# Altium schematic sheet JlinkV9-SMTV2.SchDoc
size A3
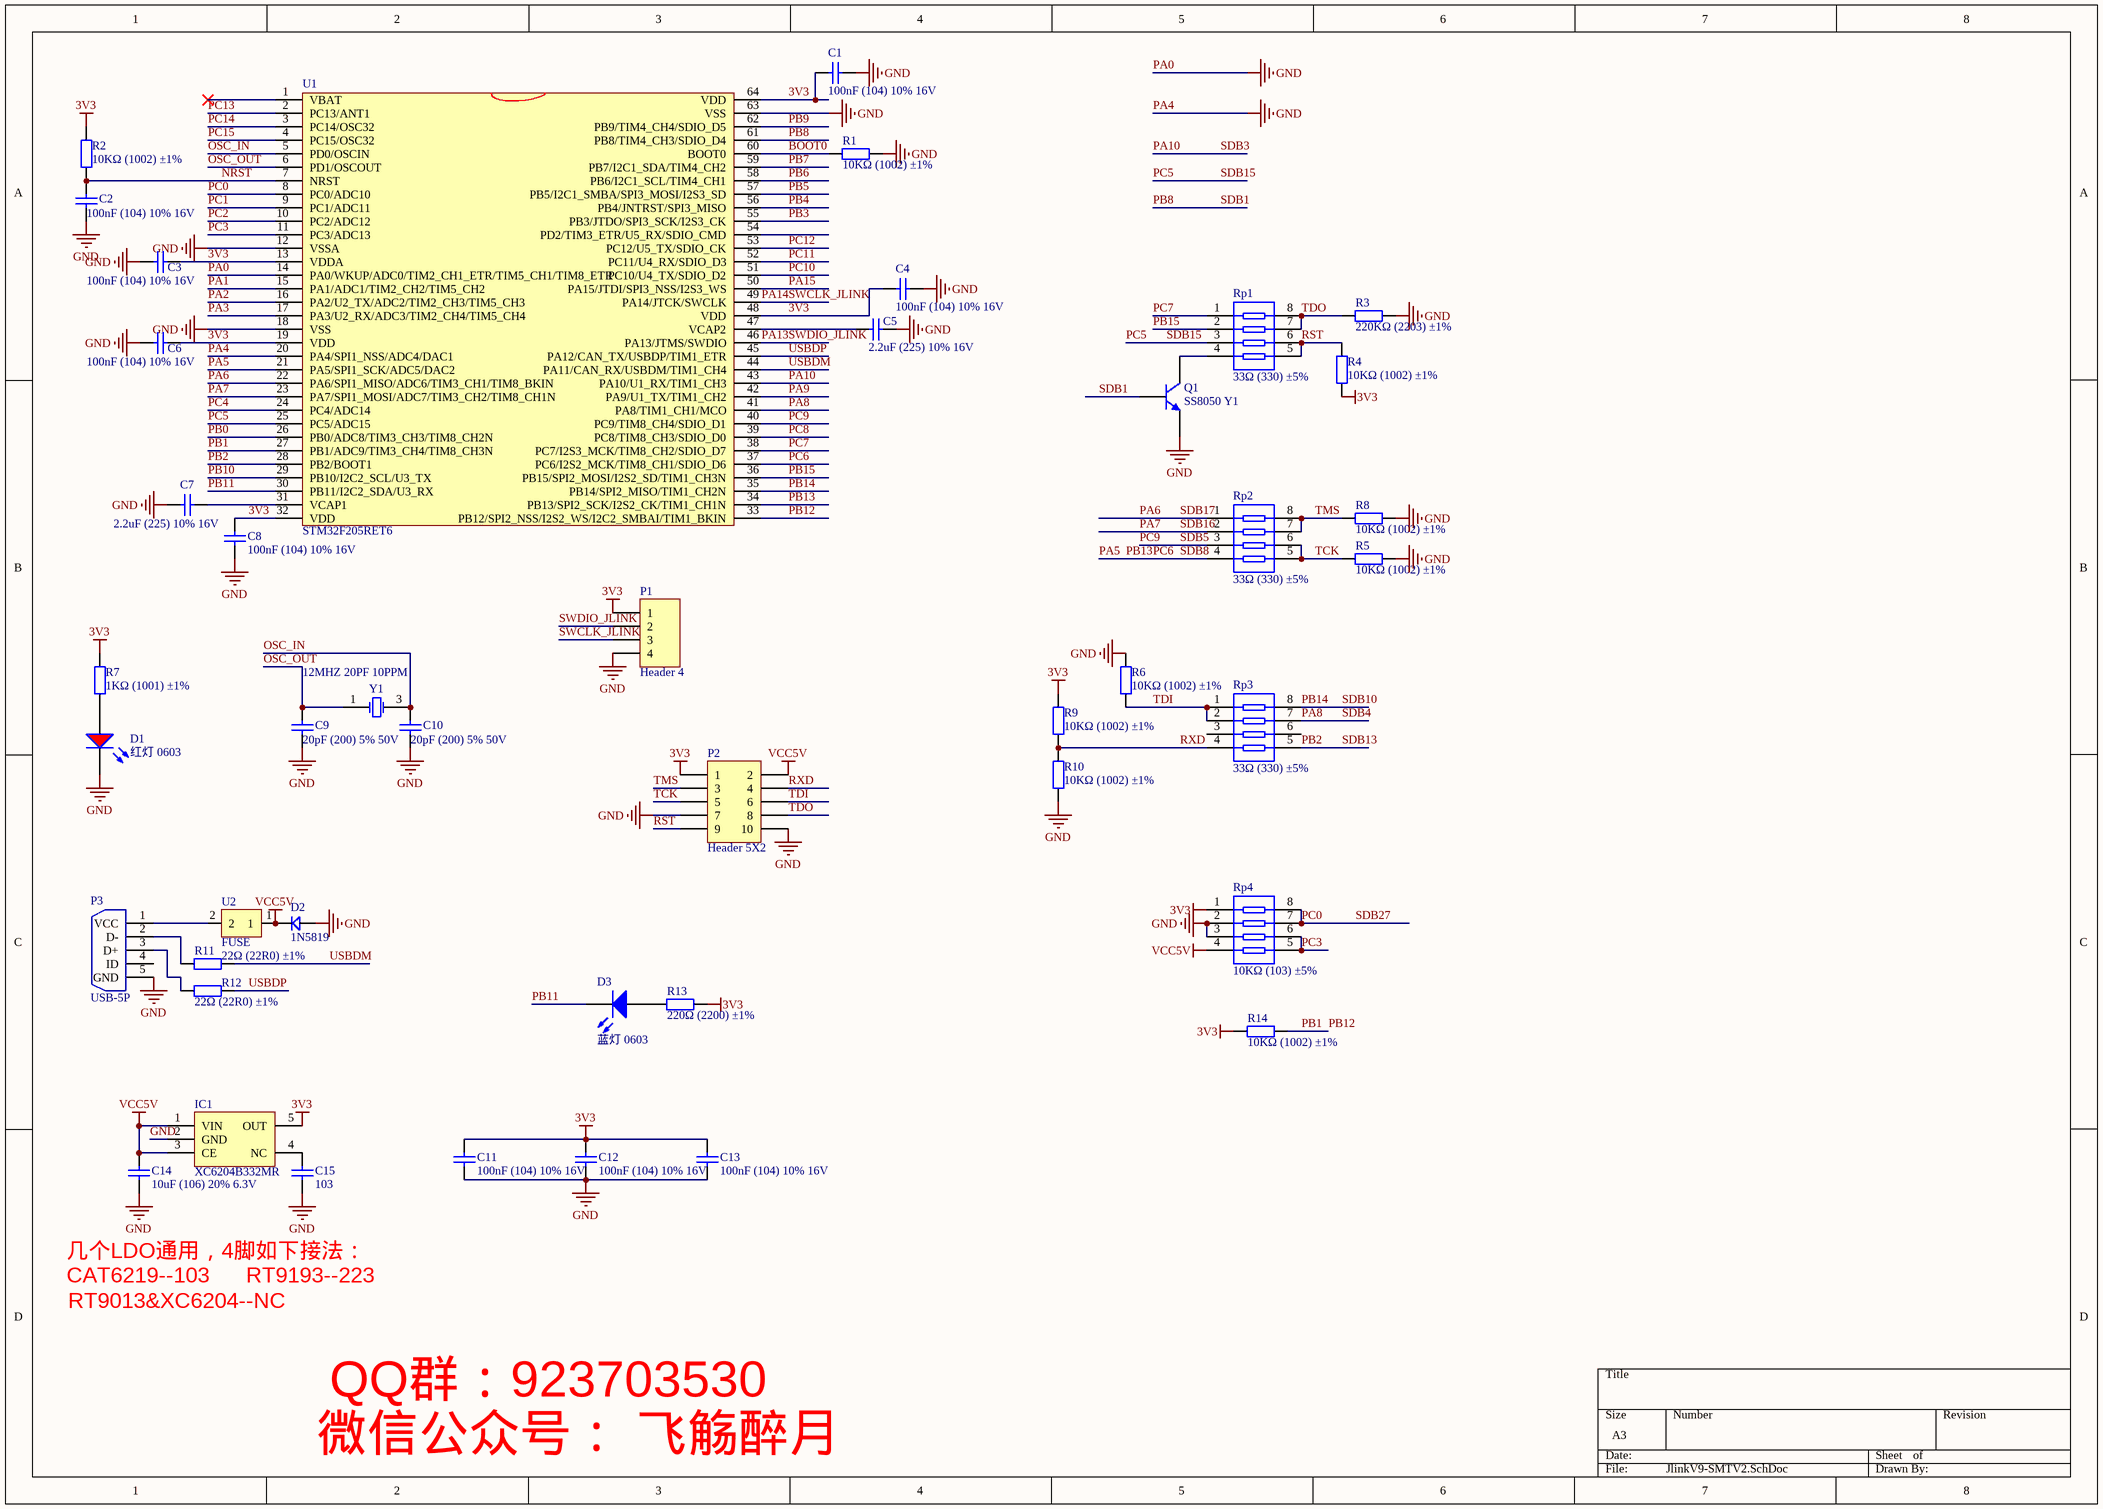
[diagram p0: JlinkV9-SMTV2.SchDoc]

## Parts
C1  100nF (104) 10% 16V  [0402_C]
C2  100nF (104) 10% 16V  [0402_C]
C3  100nF (104) 10% 16V  [0402_C]
C4  100nF (104) 10% 16V  [0402_C]
C5  2.2uF (225) 10% 16V  [0603_C]
C6  100nF (104) 10% 16V  [0402_C]
C7  2.2uF (225) 10% 16V  [0603_C]
C8  100nF (104) 10% 16V  [0402_C]
C9  20pF (200) 5% 50V  [0402_C]
C10  20pF (200) 5% 50V  [0402_C]
C11  100nF (104) 10% 16V  [0402_C]
C12  100nF (104) 10% 16V  [0402_C]
C13  100nF (104) 10% 16V  [0402_C]
C14  10uF (106) 20% 6.3V  [0402_C]
C15  103  [0402_C]
D1  红灯 0603  [0603_LED_S1]
D2  1N5819  [SOD-323]
D3  蓝灯 0603  [0603_LED_S1]
IC1  XC6204B332MR  [SOT23-5L]
P1  Header 4  [HDR1X4_SMD]
P2  Header 5X2  [HDR2X5_2.54_180H]
P3  USB-5P  [MICRO_USB]
Q1  SS8050 Y1  [SOT-23(SOT-23-3)]
R1  10KΩ (1002) ±1%  [0402_R]
R2  10KΩ (1002) ±1%  [0402_R]
R3  220KΩ (2203) ±1%  [0402_R]
R4  10KΩ (1002) ±1%  [0402_R]
R5  10KΩ (1002) ±1%  [0402_R]
R6  10KΩ (1002) ±1%  [0402_R]
R7  1KΩ (1001) ±1%  [0402_R]
R8  10KΩ (1002) ±1%  [0402_R]
R9  10KΩ (1002) ±1%  [0402_R]
R10  10KΩ (1002) ±1%  [0402_R]
R11  22Ω (22R0) ±1%  [0402_R]
R12  22Ω (22R0) ±1%  [0402_R]
R13  220Ω (2200) ±1%  [0402_R]
R14  10KΩ (1002) ±1%  [0402_R]
Rp1  33Ω (330) ±5%  [0402_Rx4]
Rp2  33Ω (330) ±5%  [0402_Rx4]
Rp3  33Ω (330) ±5%  [0402_Rx4]
Rp4  10KΩ (103) ±5%  [0402_Rx4]
U1  STM32F205RET6  [STM-LQFP64_M]
U2  FUSE  [0603_C]
Y1  12MHZ 20PF 10PPM  [SMD-3225_4P]

## Nets
3V3: C1.1 C3.2 C4.1 C6.2 C8.2 C11.2 C12.2 C13.2 IC1.5(OUT) P1.1 P2.1 R2.2 R4.1 R7.2 R9.1 R13.2 R14.1 Rp4.1 U1.13(VDDA) U1.19(VDD) U1.32(VDD) U1.48(VDD) U1.64(VDD)
GND: C1.2 C2.1 C3.1 C4.2 C5.2 C6.1 C7.1 C8.1 C9.1 C10.1 C11.1 C12.1 C13.1 C14.1 C15.1 D1.K D2.1 IC1.2(GND) P1.4 P2.7 P2.10 P3.5(GND) Q1.2(E) R1.2 R3.1 R5.1 R6.1 R8.2 R10.2 Rp4.2 Rp4.3 U1.12(VSSA) U1.14(PA0/WKUP/ADC0/TIM2_CH1_ETR/TIM5_CH1/TIM8_ETR) U1.18(VSS) U1.20(PA4/SPI1_NSS/ADC4/DAC1) U1.63(VSS)  [also labelled PA0, PA4]
VCC5V: C14.2 D2.2 IC1.1(VIN) IC1.3(CE) P2.2 Rp4.4 U2.1
BOOT0: R1.1 U1.60(BOOT0)
NRST: C2.2 R2.1 U1.7(NRST)
OSC_IN: C10.2 U1.5(PD0/OSCIN) Y1.3(OSC2)
OSC_OUT: C9.2 U1.6(PD1/OSCOUT) Y1.1(OSC1)
PA1: U1.15(PA1/ADC1/TIM2_CH2/TIM5_CH2)
PA2: U1.16(PA2/U2_TX/ADC2/TIM2_CH3/TIM5_CH3)
PA3: U1.17(PA3/U2_RX/ADC3/TIM2_CH4/TIM5_CH4)
PA5: Rp2.4 U1.21(PA5/SPI1_SCK/ADC5/DAC2) U1.34(PB13/SPI2_SCK/I2S2_CK/TIM1_CH1N) U1.37(PC6/I2S2_MCK/TIM8_CH1/SDIO_D6)  [also labelled PB13, PC6, SDB8]
PA6: Rp2.1 U1.22(PA6/SPI1_MISO/ADC6/TIM3_CH1/TIM8_BKIN)  [also labelled SDB17]
PA7: Rp2.2 U1.23(PA7/SPI1_MOSI/ADC7/TIM3_CH2/TIM8_CH1N)  [also labelled SDB16]
PA8: Rp3.7 U1.41(PA8/TIM1_CH1/MCO)  [also labelled SDB4]
PA9: U1.42(PA9/U1_TX/TIM1_CH2)
PA10: U1.43(PA10/U1_RX/TIM1_CH3)  [also labelled SDB3]
PA13: P1.2 U1.46(PA13/JTMS/SWDIO)  [also labelled SWDIO_JLINK]
PA14: P1.3 U1.49(PA14/JTCK/SWCLK)  [also labelled SWCLK_JLINK]
PA15: U1.50(PA15/JTDI/SPI3_NSS/I2S3_WS)
PB0: U1.26(PB0/ADC8/TIM3_CH3/TIM8_CH2N)
PB1: R14.2 U1.27(PB1/ADC9/TIM3_CH4/TIM8_CH3N) U1.33(PB12/SPI2_NSS/I2S2_WS/I2C2_SMBAI/TIM1_BKIN)  [also labelled PB12]
PB2: Rp3.5 U1.28(PB2/BOOT1)  [also labelled SDB13]
PB3: U1.55(PB3/JTDO/SPI3_SCK/I2S3_CK)
PB4: U1.56(PB4/JNTRST/SPI3_MISO)
PB5: U1.57(PB5/I2C1_SMBA/SPI3_MOSI/I2S3_SD)
PB6: U1.58(PB6/I2C1_SCL/TIM4_CH1)
PB7: U1.59(PB7/I2C1_SDA/TIM4_CH2)
PB8: Q1.1(B) U1.61(PB8/TIM4_CH3/SDIO_D4)  [also labelled SDB1]
PB9: U1.62(PB9/TIM4_CH4/SDIO_D5)
PB10: U1.29(PB10/I2C2_SCL/U3_TX)
PB11: D3.K U1.30(PB11/I2C2_SDA/U3_RX)
PB14: Rp3.8 U1.35(PB14/SPI2_MISO/TIM1_CH2N)  [also labelled SDB10]
PB15: Rp1.2 U1.36(PB15/SPI2_MOSI/I2S2_SD/TIM1_CH3N)
PC0: Rp4.7 Rp4.8 U1.8(PC0/ADC10)  [also labelled SDB27]
PC1: U1.9(PC1/ADC11)
PC2: U1.10(PC2/ADC12)
PC3: Rp4.5 Rp4.6 U1.11(PC3/ADC13)
PC4: U1.24(PC4/ADC14)
PC5: Rp1.3 U1.25(PC5/ADC15)  [also labelled SDB15]
PC7: Rp1.1 U1.38(PC7/I2S3_MCK/TIM8_CH2/SDIO_D7)
PC8: U1.39(PC8/TIM8_CH3/SDIO_D0)
PC9: Rp2.3 U1.40(PC9/TIM8_CH4/SDIO_D1)  [also labelled SDB5]
PC10: U1.51(PC10/U4_TX/SDIO_D2)
PC11: U1.52(PC11/U4_RX/SDIO_D3)
PC12: U1.53(PC12/U5_TX/SDIO_CK)
PC13: U1.2(PC13/ANT1)
PC14: U1.3(PC14/OSC32)
PC15: U1.4(PC15/OSC32)
RST: P2.9 R4.2 Rp1.5 Rp1.6
RXD: P2.4 R9.2 R10.1 Rp3.4
TCK: P2.5 R5.2 Rp2.5 Rp2.6
TDI: P2.6 R6.2 Rp3.1 Rp3.2
TDO: P2.8 R3.2 Rp1.7 Rp1.8
TMS: P2.3 R8.1 Rp2.7 Rp2.8
USBDM: R11.2 U1.44(PA11/CAN_RX/USBDM/TIM1_CH4)
USBDP: R12.2 U1.45(PA12/CAN_TX/USBDP/TIM1_ETR)
NetC5_1: C5.1 U1.47(VCAP2)
NetC7_2: C7.2 U1.31(VCAP1)
NetC15_2: C15.2 IC1.4(NC)
NetD1_A: D1.A R7.1
NetD3_A: D3.A R13.1
NetP3_1: P3.1(VCC) U2.2
NetP3_2: P3.2(D-) R11.1
NetP3_3: P3.3(D+) R12.1
NetQ1_3: Q1.3(C) Rp1.4

Not connected (* = marked no-connect by the designer): P3 4(ID); Rp3 3 6; U1 1(VBAT)* 54(PD2/TIM3_ETR/U5_RX/SDIO_CMD)

## Notes on the sheet
- 几个LDO通用，4脚如下接法：
- CAT6219--103
- RT9013&XC6204--NC
- RT9193--223
- 微信公众号： 飞觞醉月
- QQ群：923703530

## Library data of the parts
C1-C4 C6 C8 C11-C13 = 0402 100nF (104) 10% 16V: 贴片电容; ComponentLink1Description: 供应商链接; ComponentLink1URL: http://www.szlcsc.com/product/details_1877.html; Package: 0402; Supplier: LC; SuppliersPartNumber: C1525
C5 C7 = 0603 2.2uF (225) 10% 16V: 贴片电容; ComponentLink1Description: 供应商链接; ComponentLink1URL: http://www.szlcsc.com/product/details_24366.html; Package: 0603; Supplier: LC; SuppliersPartNumber: C23630
C9 C10 = 0402 20pF (200) 5% 50V: 贴片电容; ComponentLink1Description: 供应商链接; ComponentLink1URL: http://www.szlcsc.com/product/details_1906.html; Package: 0402; Supplier: LC; SuppliersPartNumber: C1554
C14 = 0402 10uF (106) 20% 6.3V: 贴片电容; ComponentLink1Description: 供应商链接; ComponentLink1URL: http://www.szlcsc.com/product/details_16204.html; Package: 0402; Supplier: LC; SuppliersPartNumber: C15525
C15 = 0402 10nF (103) 10% 50V: 贴片电容; ComponentLink1Description: 供应商链接; ComponentLink1URL: http://www.szlcsc.com/product/details_15869.html; Package: 0402; Supplier: LC; SuppliersPartNumber: C15195
D1 = 0603 红灯: 发光二极管; ComponentLink1Description: 供应商链接; ComponentLink1URL: http://www.szlcsc.com/product/details_2659.html; Package: 0603; Supplier: LC; SuppliersPartNumber: C2286
D2 = D
D3 = 0603 蓝灯: 发光二极管; ComponentLink1Description: 供应商链接; ComponentLink1URL: http://www.szlcsc.com/product/details_73150.html; Package: 0603; Supplier: LC; SuppliersPartNumber: C72041
IC1 = LDO XC6204: LDO; BOM名称: 稳压芯片; 版权归属: 源创客; 学习资源: www.ooocke.com
P1 = Header 4: Header, 4-Pin; LatestRevisionDate: 17-Jul-2002; LatestRevisionNote: Re-released for DXP Platform.; Publisher: Altium Limited
P2 = Header 5X2: Header, 5-Pin, Dual row; LatestRevisionDate: 17-Jul-2002; LatestRevisionNote: Re-released for DXP Platform.; Publisher: Altium Limited
P3 = USB-5P: 微型USB母座; 版权归属: 源创客; BOM名称: 微型USB母座; 学习资源: www.ooocke.com
Q1 = SOT-23 SS8050 Y1: 三极管; ComponentLink1Description: 供应商链接; ComponentLink1URL: http://www.szlcsc.com/product/details_2507.html; Package: SOT-23; Supplier: LC; SuppliersPartNumber: C2150
R1 R2 R4-R6 R8-R10 R14 = 0402 10KΩ (1002) 1%: 贴片电阻; ComponentLink1Description: 供应商链接; ComponentLink1URL: http://www.szlcsc.com/product/details_26487.html; Package: 0402; Supplier: LC; SuppliersPartNumber: C25744
R3 = 0402 220KΩ (2203) 1%: 贴片电阻; ComponentLink1Description: 供应商链接; ComponentLink1URL: http://www.szlcsc.com/product/details_26510.html; Package: 0402; Supplier: LC; SuppliersPartNumber: C25767
R7 = 0402 1KΩ (1001) 1%: 贴片电阻; ComponentLink1Description: 供应商链接; ComponentLink1URL: http://www.szlcsc.com/product/details_12256.html; Package: 0402; Supplier: LC; SuppliersPartNumber: C11702
R11 R12 = 0402 22Ω (22R0) 1%: 贴片电阻; ComponentLink1Description: 供应商链接; ComponentLink1URL: http://www.szlcsc.com/product/details_25835.html; Package: 0402; Supplier: LC; SuppliersPartNumber: C25092
R13 = 0402 220Ω (2200) 1%: 贴片电阻; ComponentLink1Description: 供应商链接; ComponentLink1URL: http://www.szlcsc.com/product/details_25834.html; Package: 0402; Supplier: LC; SuppliersPartNumber: C25091
Rp1-Rp3 = 0402*4 33Ω (330) 5%: 贴片排阻; ComponentLink1Description: 供应商链接; ComponentLink1URL: http://www.szlcsc.com/product/details_26244.html; Package: 0402*4; Supplier: LC; SuppliersPartNumber: C25501
Rp4 = 0402*4 10KΩ (103) 5%: 贴片排阻; ComponentLink1Description: 供应商链接; ComponentLink1URL: http://www.szlcsc.com/product/details_26468.html; Package: 0402*4; Supplier: LC; SuppliersPartNumber: C25725
Y1 = SMD-3225_4P  12MHZ 20PF 10PPM: 贴片晶振; ComponentLink1Description: 供应商链接; ComponentLink1URL: http://www.szlcsc.com/product/details_9522.html; Package: SMD-3225_4P; Supplier: LC; SuppliersPartNumber: C9002